# Altium schematic sheet DDS.SchDoc
size B; Organization: Mechanart, LLC; Address1: 397 Laurie Meadows Drive; Address2: Apt. 437; Address3: San Mateo, CA 94403
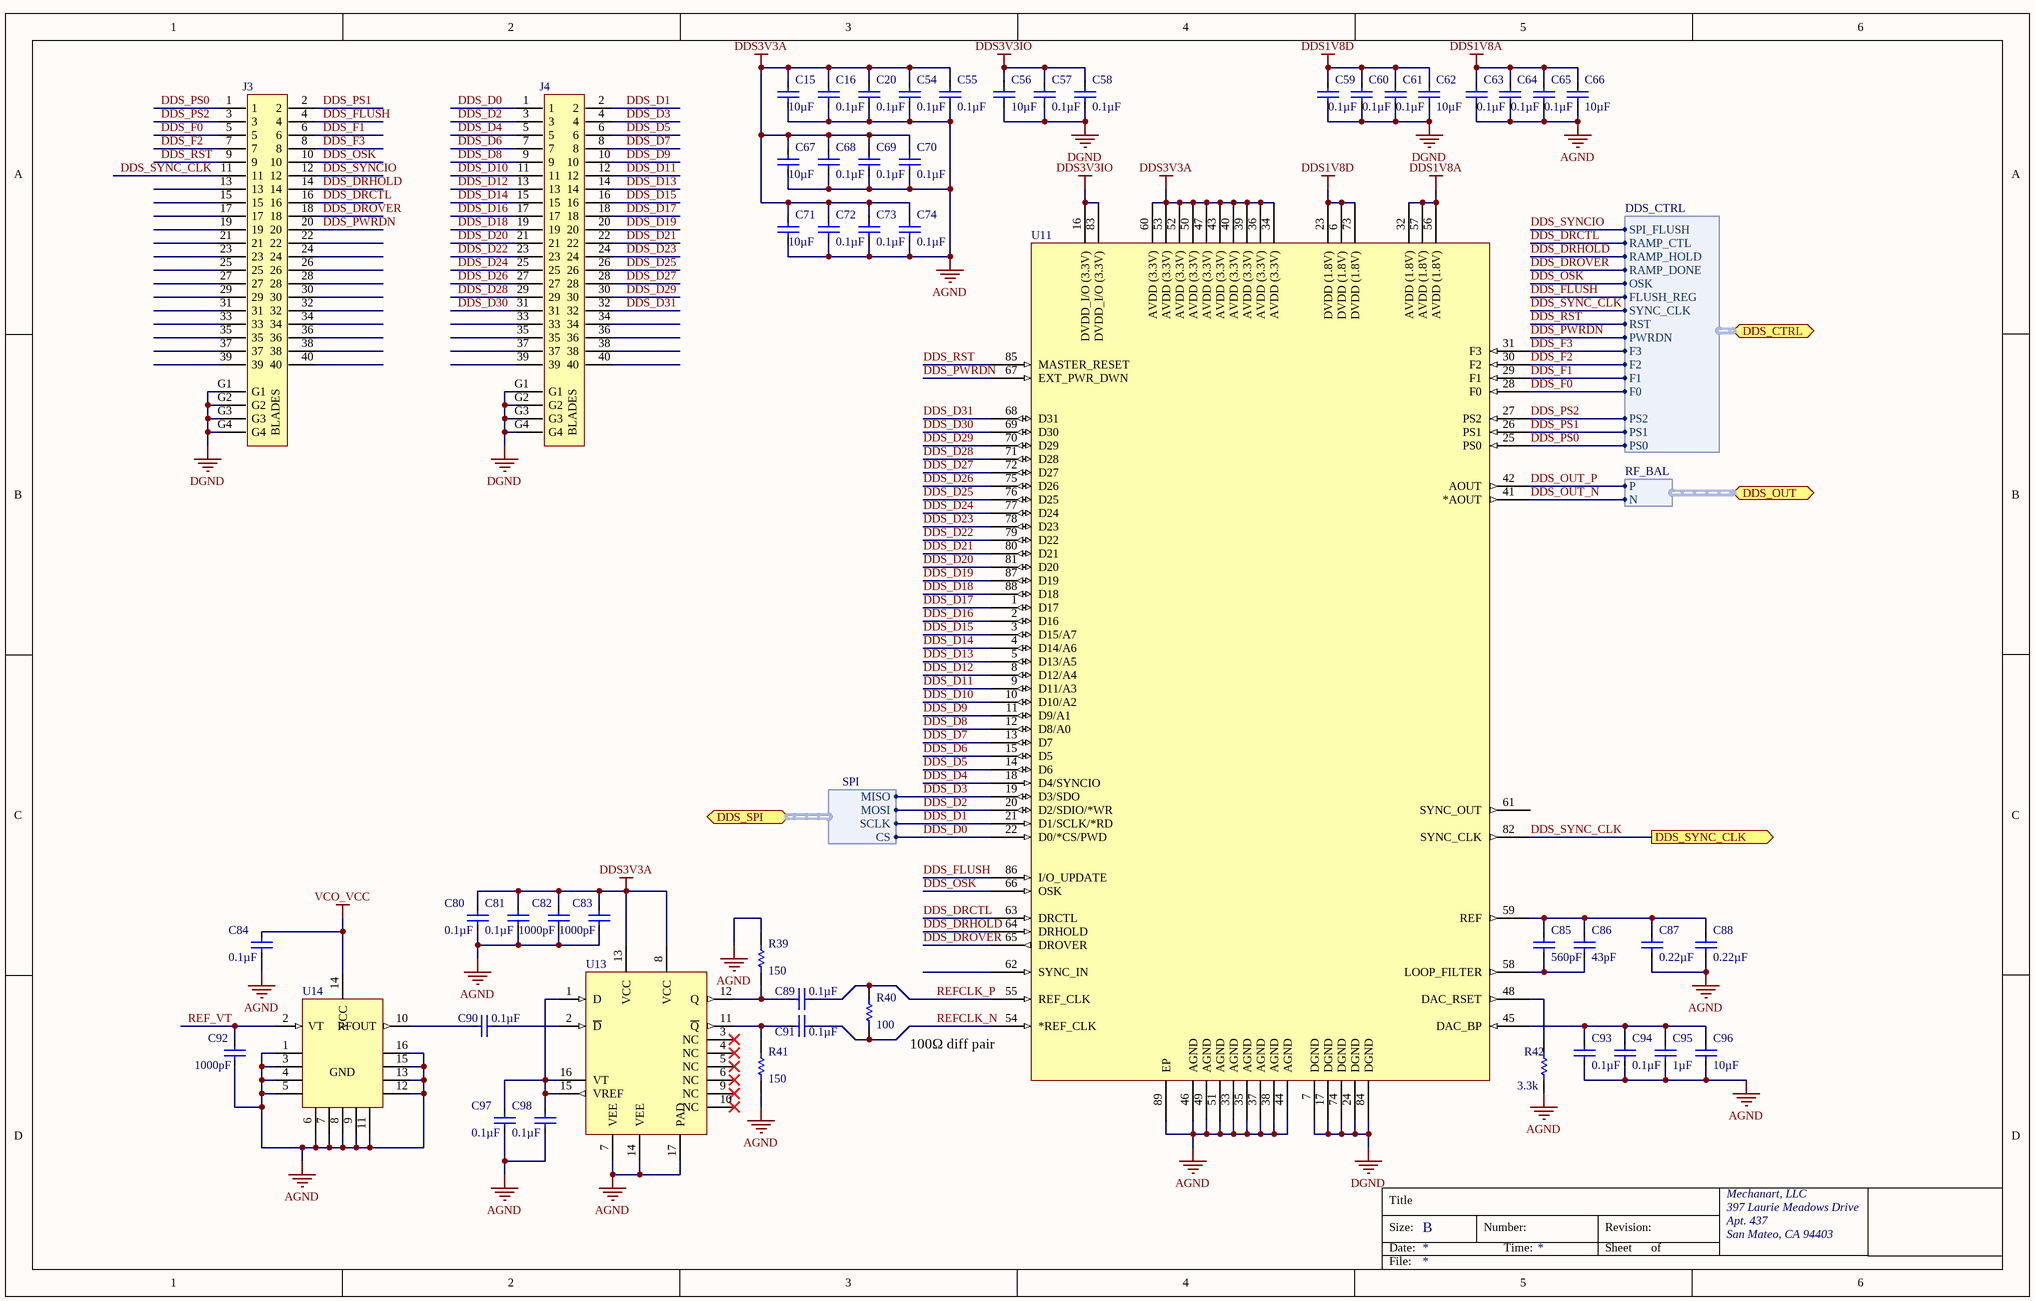
[diagram p0: DDS.SchDoc]

## Parts
C15  10µF  [CAPC1608X85L22N]
C16  0.1µF  [CAPC1005X55L25N]
C20  0.1µF  [CAPC1005X55L25N]
C54  0.1µF  [CAPC1005X55L25N]
C55  0.1µF  [CAPC1005X55L25N]
C56  10µF  [CAPC1608X85L22N]
C57  0.1µF  [CAPC1005X55L25N]
C58  0.1µF  [CAPC1005X55L25N]
C59  0.1µF  [CAPC1005X55L25N]
C60  0.1µF  [CAPC1005X55L25N]
C61  0.1µF  [CAPC1005X55L25N]
C62  10µF  [CAPC1608X85L22N]
C63  0.1µF  [CAPC1005X55L25N]
C64  0.1µF  [CAPC1005X55L25N]
C65  0.1µF  [CAPC1005X55L25N]
C66  10µF  [CAPC1608X85L22N]
C67  10µF  [CAPC1608X85L22N]
C68  0.1µF  [CAPC1005X55L25N]
C69  0.1µF  [CAPC1005X55L25N]
C70  0.1µF  [CAPC1005X55L25N]
C71  10µF  [CAPC1608X85L22N]
C72  0.1µF  [CAPC1005X55L25N]
C73  0.1µF  [CAPC1005X55L25N]
C74  0.1µF  [CAPC1005X55L25N]
C80  0.1µF  [CAPC1005X50L25N]
C81  0.1µF  [CAPC1005X50L25N]
C82  1000pF  [CAPC1005X50L25N]
C83  1000pF  [CAPC1005X50L25N]
C84  0.1µF  [CAPC1005X50L25N]
C85  560pF  [CAPC1005X50L25N]
C86  43pF  [CAPC1005X50L25N]
C87  0.22µF  [CAPC1005X50L25N]
C88  0.22µF  [CAPC1005X50L25N]
C89  0.1µF  [CAPC1005X55L25N]
C90  0.1µF  [CAPC1005X55L25N]
C91  0.1µF  [CAPC1005X55L25N]
C92  1000pF  [CAPC1005X50L25N]
C93  0.1µF  [CAPC1005X55L25N]
C94  0.1µF  [CAPC1005X55L25N]
C95  1µF  [CAPC1608X85L22N]
C96  10µF  [CAPC1608X85L22N]
C97  0.1µF  [CAPC1005X50L25N]
C98  0.1µF  [CAPC1005X50L25N]
J3  QSE-020-01-X-D-A  [QSE-020-01-X-D-A]  (value not drawn)
J4  QSE-020-01-X-D-A  [QSE-020-01-X-D-A]  (value not drawn)
R39  150  [RESC1005X40L25N]
R40  100  [RESC1005X40L25N]
R41  150  [RESC1005X40L25N]
R42  3.3k  [RESC1005X40L25N]
U11  AD9914BCPZ  [QFN50P1200X1200X90-89T670X670N]  (value not drawn)
U13  ADCLK905  [QFN50P300X300X90-17T150X150N]  (value not drawn)
U14  CVCO55  [CVCO55]  (value not drawn)

## Ports
DDS_CTRL (harness DDS_CTRL), DDS_OUT (harness RF_BAL), DDS_SPI (harness SPI), DDS_SYNC_CLK (out)

## Harnesses
RF_BAL: P, N
DDS_CTRL: F0, F1, F2, F3, PS0, PS1, PS2, RST, PWRDN, SYNC_CLK, RAMP_CTL, RAMP_HOLD, RAMP_DONE, OSK, FLUSH_REG, SPI_FLUSH
SPI: MISO, MOSI, SCLK, CS

## Nets
AGND: C15.2 C16.2 C20.2 C54.2 C55.2 C63.2 C64.2 C65.2 C66.2 C67.2 C68.2 C69.2 C70.2 C71.2 C72.2 C73.2 C74.2 C80.2 C81.2 C82.2 C83.2 C84.2 C87.2 C88.2 C92.2 C93.2 C94.2 C95.2 C96.2 C97.2 C98.2 R39.2 R41.1 R42.1 U11.33(AGND) U11.35(AGND) U11.37(AGND) U11.38(AGND) U11.44(AGND) U11.46(AGND) U11.49(AGND) U11.51(AGND) U11.89(EP) U13.7(VEE) U13.14(VEE) U13.17(PAD) U14.1(GND) U14.3(GND) U14.4(GND) U14.5(GND) U14.6(GND) U14.7(GND) U14.8(GND) U14.9(GND) U14.11(GND) U14.12(GND) U14.13(GND) U14.15(GND) U14.16(GND)
DDS1V8A: C63.1 C64.1 C65.1 C66.1 U11.32(AVDD_(1.8V)) U11.56(AVDD_(1.8V)) U11.57(AVDD_(1.8V))
DDS1V8D: C59.1 C60.1 C61.1 C62.1 U11.6(DVDD_(1.8V)) U11.23(DVDD_(1.8V)) U11.73(DVDD_(1.8V))
DDS3V3A: C15.1 C16.1 C20.1 C54.1 C55.1 C67.1 C68.1 C69.1 C70.1 C71.1 C72.1 C73.1 C74.1 C80.1 C81.1 C82.1 C83.1 U11.34(AVDD_(3.3V)) U11.36(AVDD_(3.3V)) U11.39(AVDD_(3.3V)) U11.40(AVDD_(3.3V)) U11.43(AVDD_(3.3V)) U11.47(AVDD_(3.3V)) U11.50(AVDD_(3.3V)) U11.52(AVDD_(3.3V)) U11.53(AVDD_(3.3V)) U11.60(AVDD_(3.3V)) U13.8(VCC) U13.13(VCC)
DDS3V3IO: C56.1 C57.1 C58.1 U11.16(DVDD_I/O_(3.3V)) U11.83(DVDD_I/O_(3.3V))
DGND: C56.2 C57.2 C58.2 C59.2 C60.2 C61.2 C62.2 J3.G1 J3.G2 J3.G3 J3.G4 J4.G1 J4.G2 J4.G3 J4.G4 U11.7(DGND) U11.17(DGND) U11.24(DGND) U11.74(DGND) U11.84(DGND)
VCO_VCC: C84.1 U14.14(VCC)
DDS_D0: J4.1 U11.22(D0/*CS/PWD) ; port DDS_SPI.CS
DDS_D1: J4.2 U11.21(D1/SCLK/*RD) ; port DDS_SPI.SCLK
DDS_D2: J4.3 U11.20(D2/SDIO/*WR) ; port DDS_SPI.MOSI
DDS_D3: J4.4 U11.19(D3/SDO) ; port DDS_SPI.MISO
DDS_D4: J4.5 U11.18(D4/SYNCIO)
DDS_D5: J4.6 U11.14(D6)
DDS_D6: J4.7 U11.15(D5)
DDS_D7: J4.8 U11.13(D7)
DDS_D8: J4.9 U11.12(D8/A0)
DDS_D9: J4.10 U11.11(D9/A1)
DDS_D10: J4.11 U11.10(D10/A2)
DDS_D11: J4.12 U11.9(D11/A3)
DDS_D12: J4.13 U11.8(D12/A4)
DDS_D13: J4.14 U11.5(D13/A5)
DDS_D14: J4.15 U11.4(D14/A6)
DDS_D15: J4.16 U11.3(D15/A7)
DDS_D16: J4.17 U11.2(D16)
DDS_D17: J4.18 U11.1(D17)
DDS_D18: J4.19 U11.88(D18)
DDS_D19: J4.20 U11.87(D19)
DDS_D20: J4.21 U11.81(D20)
DDS_D21: J4.22 U11.80(D21)
DDS_D22: J4.23 U11.79(D22)
DDS_D23: J4.24 U11.78(D23)
DDS_D24: J4.25 U11.77(D24)
DDS_D25: J4.26 U11.76(D25)
DDS_D26: J4.27 U11.75(D26)
DDS_D27: J4.28 U11.72(D27)
DDS_D28: J4.29 U11.71(D28)
DDS_D29: J4.30 U11.70(D29)
DDS_D30: J4.31 U11.69(D30)
DDS_D31: J4.32 U11.68(D31)
DDS_DRCTL: J3.16 U11.63(DRCTL) ; port DDS_CTRL.RAMP_CTL
DDS_DRHOLD: J3.14 U11.64(DRHOLD) ; port DDS_CTRL.RAMP_HOLD
DDS_DROVER: J3.18 U11.65(DROVER) ; port DDS_CTRL.RAMP_DONE
DDS_F0: J3.5 U11.28(F0) ; port DDS_CTRL.F0
DDS_F1: J3.6 U11.29(F1) ; port DDS_CTRL.F1
DDS_F2: J3.7 U11.30(F2) ; port DDS_CTRL.F2
DDS_F3: J3.8 U11.31(F3) ; port DDS_CTRL.F3
DDS_FLUSH: J3.4 U11.86(I/O_UPDATE) ; port DDS_CTRL.FLUSH_REG
DDS_OSK: J3.10 U11.66(OSK) ; port DDS_CTRL.OSK
DDS_OUT_N: U11.41(*AOUT) ; port DDS_OUT.N
DDS_OUT_P: U11.42(AOUT) ; port DDS_OUT.P
DDS_PS0: J3.1 U11.25(PS0) ; port DDS_CTRL.PS0
DDS_PS1: J3.2 U11.26(PS1) ; port DDS_CTRL.PS1
DDS_PS2: J3.3 U11.27(PS2) ; port DDS_CTRL.PS2
DDS_PWRDN: J3.20 U11.67(EXT_PWR_DWN) ; port DDS_CTRL.PWRDN
DDS_RST: J3.9 U11.85(MASTER_RESET) ; port DDS_CTRL.RST
DDS_SYNC_CLK: J3.11 U11.82(SYNC_CLK) ; port DDS_SYNC_CLK, port DDS_CTRL.SYNC_CLK
DDS_SYNCIO: J3.12 ; port DDS_CTRL.SPI_FLUSH
REF_VT: C92.1 U14.2(VT)
REFCLK_N: C91.2 R40.1 U11.54(*REF_CLK)
REFCLK_P: C89.2 R40.2 U11.55(REF_CLK)
NetC85_1: C85.1 C86.1 C87.1 C88.1 U11.59(REF)
NetC85_2: C85.2 C86.2 U11.58(LOOP_FILTER)
NetC89_1: C89.1 R39.1 U13.12(Q)
NetC90_1: C90.1 U14.10(RFOUT)
NetC90_2: C90.2 U13.2(~{D})
NetC91_1: C91.1 R41.2 U13.11(~{Q})
NetC93_1: C93.1 C94.1 C95.1 C96.1 U11.45(DAC_BP)
NetC97_1: C97.1 C98.1 U13.1(D) U13.15(VREF) U13.16(VT)
NetR42_2: R42.2 U11.48(DAC_RSET)

Not connected (* = marked no-connect by the designer): J3 13 15 17 19 21 22 23 24 25 26 27 28 29 30 31 32 33 34 35 36 37 38 39 40; J4 33 34 35 36 37 38 39 40; U11 61(SYNC_OUT) 62(SYNC_IN); U13 3(NC)* 4(NC)* 5(NC)* 6(NC)* 9(NC)* 10(NC)*

## Notes on the sheet
- (near U11) 100Ω diff pair
- Title
- Size:
- Date:
- B
- Number:
- Time:
- Revision:
- Sheet
- of
- File:
- (in symbol QSE-020-01-L-D-A) BLADES

## Library data of the parts
C15 C56 C62 C66 C67 C71 C96 = GRM31CR71E106KA12L: CAP CER 10UF 25V X7R 1206; Manufacturer: Murata Electronics North America; Tolerance: ±10%; Design Item Id: GRM31CR71E106KA12L; Supplier 1: Digi-Key; Supplier Part Number 1: 490-6518-1-ND; Manufacturer Part Number: GRM31CR71E106KA12L; RoHS: RoHS Compliant; Category: Capacitors; Stock 1: 157542; Pricing 1: 1=0.83, 10=0.706, 50=0.5194, 100=0.4129, 250=0.34632, 500=0.31302, 1000=0.28638 (USD); Packaging: Cut Tape (CT); Applications: General Purpose; Operating Temperature: -55°C ~ 125°C; Mounting Type: Surface Mount, MLCC; Package / Case: 1206 (3216 Metric); ComponentLink1URL: http://www.murata.com/~/media/webrenewal/support/library/catalog/products/capacitor/mlcc/c02e.pdf; ComponentLink1Description: http://www.murata.com/~/media/webrenewal/support/library/catalog/products/capacitor/mlcc/c02e.pdf; Capacitance: 10µF; Voltage - Rated: 25V; Temperature Coefficient: X7R; Ratings: -; Size / Dimension: 0.126" L x 0.063" W (3.20mm x 1.60mm); Height - Seated (Max): -; Thickness (Max): 0.071" (1.80mm); Lead Spacing: -; Features: -; Lead Style: -
C16 C20 C54 C55 C57-C61 C63-C65 C68-C70 C72-C74 C89-C91 C93 C94 = GRM155R71C104JA88D: CAP CER 0.1UF 16V X7R 0402; Manufacturer: Murata Electronics North America; Tolerance: ±5%; Design Item Id: GRM155R71C104JA88D; Supplier 1: Digi-Key; Supplier Part Number 1: 490-6327-1-ND; Manufacturer Part Number: GRM155R71C104JA88D; RoHS: RoHS Compliant; Category: Capacitors; Stock 1: 844721; Pricing 1: 1=0.1, 10=0.026, 50=0.0144, 100=0.0121, 250=0.00992, 500=0.00848, 1000=0.0066, 5000=0.0055 (USD); Packaging: Cut Tape (CT); Applications: General Purpose; Operating Temperature: -55°C ~ 125°C; Mounting Type: Surface Mount, MLCC; Package / Case: 0402 (1005 Metric); ComponentLink1URL: http://www.murata.com/~/media/webrenewal/support/library/catalog/products/capacitor/mlcc/c02e.pdf; ComponentLink1Description: http://www.murata.com/~/media/webrenewal/support/library/catalog/products/capacitor/mlcc/c02e.pdf; Capacitance: 0.1µF; Voltage - Rated: 16V; Temperature Coefficient: X7R; Ratings: -; Size / Dimension: 0.039" L x 0.020" W (1.00mm x 0.50mm); Height - Seated (Max): -; Thickness (Max): 0.022" (0.55mm); Lead Spacing: -; Features: -; Lead Style: *
C80 C81 C84 C97 C98 = GRM155R71H104KE14D: CAP CER 0.1UF 50V X7R 0402; Manufacturer: Murata Electronics North America; Tolerance: ±10%; Design Item Id: GRM155R71H104KE14D; Supplier 1: Digi-Key; Supplier Part Number 1: 490-10700-1-ND; Manufacturer Part Number: GRM155R71H104KE14D; RoHS: RoHS Compliant; Category: Capacitors; Stock 1: 28600; Pricing 1: 1=0.1, 10=0.029, 50=0.0156, 100=0.0132, 250=0.0108, 500=0.00924, 1000=0.0072, 5000=0.006 (USD); Packaging: Cut Tape (CT); Applications: General Purpose; Operating Temperature: -55°C ~ 125°C; Mounting Type: Surface Mount, MLCC; Package / Case: 0402 (1005 Metric); ComponentLink1URL: http://www.murata.com/~/media/webrenewal/support/library/catalog/products/capacitor/mlcc/c02e.ashx; ComponentLink1Description: http://www.murata.com/~/media/webrenewal/support/library/catalog/products/capacitor/mlcc/c02e.ashx; Capacitance: 0.1µF; Voltage - Rated: 50V; Temperature Coefficient: X7R; Ratings: -; Size / Dimension: 0.039" L x 0.020" W (1.00mm x 0.50mm); Height - Seated (Max): -; Thickness (Max): 0.022" (0.55mm); Lead Spacing: -; Features: -; Lead Style: -
C82 C83 C92 = GRM1555C1H102JA01D: CAP CER 1000PF 50V NP0 0402; Manufacturer: Murata Electronics North America; Tolerance: ±5%; Temperature Coefficient: C0G, NP0; Design Item Id: GRM1555C1H102JA01D; Supplier 1: Digi-Key; Supplier Part Number 1: 490-3244-1-ND; Manufacturer Part Number: GRM1555C1H102JA01D; RoHS: RoHS Compliant; Category: Capacitors; Stock 1: 4551320; Pricing 1: 1=0.1, 10=0.065, 50=0.0354, 100=0.03, 250=0.02452, 500=0.02098, 1000=0.01635, 5000=0.01363 (USD); Packaging: Cut Tape (CT); Applications: General Purpose; Operating Temperature: -55°C ~ 125°C; Mounting Type: Surface Mount, MLCC; Package / Case: 0402 (1005 Metric); ComponentLink1URL: http://www.murata.com/~/media/webrenewal/support/library/catalog/products/capacitor/mlcc/c02e.pdf; ComponentLink1Description: http://www.murata.com/~/media/webrenewal/support/library/catalog/products/capacitor/mlcc/c02e.pdf; Capacitance: 1000pF; Voltage - Rated: 50V; Ratings: -; Size / Dimension: 0.039" L x 0.020" W (1.00mm x 0.50mm); Height - Seated (Max): -; Thickness (Max): 0.022" (0.55mm); Lead Spacing: -; Features: -; Lead Style: -
C85 = GRM1555C1H561JA01D: CAP CER 560PF 50V NP0 0402; Manufacturer: Murata Electronics North America; Tolerance: ±5%; Temperature Coefficient: C0G, NP0; Design Item Id: GRM1555C1H561JA01D; Supplier 1: Digi-Key; Supplier Part Number 1: 490-3238-1-ND; Manufacturer Part Number: GRM1555C1H561JA01D; RoHS: RoHS Compliant; Category: Capacitors; Stock 1: 73113; Pricing 1: 1=0.1, 10=0.053, 50=0.0286, 100=0.0242, 250=0.0198, 500=0.01694, 1000=0.0132, 5000=0.011 (USD); Packaging: Cut Tape (CT); Applications: General Purpose; Operating Temperature: -55°C ~ 125°C; Mounting Type: Surface Mount, MLCC; Package / Case: 0402 (1005 Metric); ComponentLink1URL: http://www.murata.com/~/media/webrenewal/support/library/catalog/products/capacitor/mlcc/c02e.pdf; ComponentLink1Description: http://www.murata.com/~/media/webrenewal/support/library/catalog/products/capacitor/mlcc/c02e.pdf; Capacitance: 560pF; Voltage - Rated: 50V; Ratings: -; Size / Dimension: 0.039" L x 0.020" W (1.00mm x 0.50mm); Height - Seated (Max): -; Thickness (Max): 0.022" (0.55mm); Lead Spacing: -; Features: -; Lead Style: -
C86 = GRM1555C1H430JA01D: CAP CER 43PF 50V NP0 0402; Manufacturer: Murata Electronics North America; Tolerance: ±5%; Temperature Coefficient: C0G, NP0; Design Item Id: GRM1555C1H430JA01D; Supplier 1: Digi-Key; Supplier Part Number 1: 490-5941-1-ND; Manufacturer Part Number: GRM1555C1H430JA01D; RoHS: RoHS Compliant; Category: Capacitors; Stock 1: 105146; Pricing 1: 1=0.1, 10=0.026, 50=0.0144, 100=0.0121, 250=0.00992, 500=0.00848, 1000=0.0066, 5000=0.0055 (USD); Packaging: Cut Tape (CT); Applications: General Purpose; Operating Temperature: -55°C ~ 125°C; Mounting Type: Surface Mount, MLCC; Package / Case: 0402 (1005 Metric); ComponentLink1URL: http://www.murata.com/~/media/webrenewal/support/library/catalog/products/capacitor/mlcc/c02e.pdf; ComponentLink1Description: http://www.murata.com/~/media/webrenewal/support/library/catalog/products/capacitor/mlcc/c02e.pdf; Capacitance: 43pF; Voltage - Rated: 50V; Ratings: -; Size / Dimension: 0.039" L x 0.020" W (1.00mm x 0.50mm); Height - Seated (Max): -; Thickness (Max): 0.022" (0.55mm); Lead Spacing: -; Features: -; Lead Style: -
C87 C88 = GRT155R6YA224KE01D: CAP CER 0.22UF 35V 10% X5R 0402; Manufacturer: Murata Electronics North America; Design Item Id: GRT155R6YA224KE01D; Supplier 1: Digi-Key; Supplier Part Number 1: 490-12271-1-ND; Manufacturer Part Number: GRT155R6YA224KE01D; RoHS: RoHS Compliant; Category: Capacitors; Stock 1: 8428; Pricing 1: 1=0.1, 10=0.054, 50=0.0292, 100=0.0248, 250=0.02024, 500=0.01732, 1000=0.0135, 5000=0.01125 (USD); Packaging: Cut Tape (CT); Applications: Automotive; Operating Temperature: -55°C ~ 85°C; Mounting Type: Surface Mount, MLCC; Package / Case: 0402 (1005 Metric); ComponentLink1URL: http://search.murata.co.jp/Ceramy/image/img/A01X/G101/ENG/GRT155R6YA224KE01-01.pdf; ComponentLink1Description: http://search.murata.co.jp/Ceramy/image/img/A01X/G101/ENG/GRT155R6YA224KE01-01.pdf; Capacitance: 0.22µF; Tolerance: ±10%; Voltage - Rated: 35V; Temperature Coefficient: X5R; Ratings: AEC-Q200; Size / Dimension: 0.039" L x 0.020" W (1.00mm x 0.50mm); Height - Seated (Max): -; Thickness (Max): 0.022" (0.55mm); Lead Spacing: -; Features: Derating Recommended; Lead Style: -
C95 = EMK107B7105KA-T: CAP CER 1UF 16V X7R 0603; Manufacturer: Taiyo Yuden; Tolerance: ±10%; Design Item Id: EMK107B7105KA-T; Supplier 1: Digi-Key; Supplier Part Number 1: 587-1241-1-ND; Manufacturer Part Number: EMK107B7105KA-T; RoHS: RoHS Compliant; Category: Capacitors; Stock 1: 3073749; Pricing 1: 1=0.1, 10=0.06, 50=0.0326, 100=0.0275, 250=0.02252, 500=0.01926, 1000=0.015 (USD); Packaging: Cut Tape (CT); Applications: General Purpose; Operating Temperature: -55°C ~ 125°C; Mounting Type: Surface Mount, MLCC; Package / Case: 0603 (1608 Metric); ComponentLink1URL: http://ds.yuden.co.jp/TYCOMPAS/ut/detail.do?productNo=EMK107B7105KA-T&fileName=EMK107B7105KA-T_SS&mode=specSheetDownload; ComponentLink1Description: http://ds.yuden.co.jp/TYCOMPAS/ut/detail.do?productNo=EMK107B7105KA-T&fileName=EMK107B7105KA-T_SS&mode=specSheetDownload; Capacitance: 1µF; Voltage - Rated: 16V; Temperature Coefficient: X7R; Ratings: -; Size / Dimension: 0.063" L x 0.031" W (1.60mm x 0.80mm); Height - Seated (Max): -; Thickness (Max): 0.035" (0.90mm); Lead Spacing: -; Features: -; Lead Style: -
J3 J4 = QSE-020-01-L-D-A: CONN RCPT HI-SPEED DUAL 40POS; Manufacturer: Samtec Inc.; Connector Type: Receptacle, Center Strip Contacts; Number of Positions: 40; Pitch: 0.031" (0.80mm); Design Item Id: QSE-020-01-L-D-A; Supplier 1: Digi-Key; Supplier Part Number 1: SAM8123-ND; Manufacturer Part Number: QSE-020-01-L-D-A; RoHS: RoHS Compliant; Category: Connectors, Interconnects; Stock 1: 1862; Pricing 1: 1=7.22, 10=6.594, 50=5.652, 100=5.024, 250=4.553, 500=4.239, 1000=4.0035, 2500=3.8465, 5000=3.768 (USD); Packaging: Tray; Mounting Type: Surface Mount; Number of Rows: 2; Features: Board Guide, Ground Bus (Plane); Contact Finish: Gold; Contact Finish Thickness: 10µin (0.25µm)
R39 R41 = ERJ-2RKF1500X: RES SMD 150 OHM 1% 1/10W 0402; Manufacturer: Panasonic Electronic Components; Power (Watts): 0.1W, 1/10W; Temperature Coefficient: ±100ppm/°C; Resistance: 150; Design Item Id: ERJ-2RKF1500X; Footprint: RESC_1005[0402]_N; Supplier 1: Digi-Key; Supplier Part Number 1: P150LCT-ND; Manufacturer Part Number: ERJ-2RKF1500X; RoHS: RoHS Compliant; Category: Resistors; Stock 1: 1792947; Pricing 1: 1=0.1, 50=0.015, 100=0.011, 250=0.0084, 500=0.00674, 1000=0.00496, 5000=0.00355 (USD); Packaging: Cut Tape (CT); Operating Temperature: -55°C ~ 155°C; Package / Case: 0402 (1005 Metric); Supplier Device Package: 0402; ComponentLink1URL: http://industrial.panasonic.com/www-cgi/jvcr13pz.cgi?E+PZ+3+AOA0002+ERJ2RKF1500X+7+WW; ComponentLink1Description: http://industrial.panasonic.com/www-cgi/jvcr13pz.cgi?E+PZ+3+AOA0002+ERJ2RKF1500X+7+WW; Tolerance: ±1%; Composition: Thick Film; Features: Automotive AEC-Q200; Size / Dimension: 0.039" L x 0.020" W (1.00mm x 0.50mm); Height: 0.016" (0.40mm); Number of Terminations: 2
R40 = ERJ-2RKF1000X: RES SMD 100 OHM 1% 1/10W 0402; Manufacturer: Panasonic Electronic Components; Power (Watts): 0.1W, 1/10W; Temperature Coefficient: ±100ppm/°C; Resistance: 100; Design Item Id: ERJ-2RKF1000X; Footprint: RESC_1005[0402]_N; Supplier 1: Digi-Key; Supplier Part Number 1: P100LCT-ND; Manufacturer Part Number: ERJ-2RKF1000X; RoHS: RoHS Compliant; Category: Resistors; Stock 1: 7555921; Pricing 1: 1=0.1, 50=0.015, 100=0.011, 250=0.0084, 500=0.00674, 1000=0.00496, 5000=0.00355 (USD); Packaging: Cut Tape (CT); Operating Temperature: -55°C ~ 155°C; Package / Case: 0402 (1005 Metric); Supplier Device Package: 0402; ComponentLink1URL: http://industrial.panasonic.com/www-cgi/jvcr13pz.cgi?E+PZ+3+AOA0002+ERJ2RKF1000X+7+WW; ComponentLink1Description: http://industrial.panasonic.com/www-cgi/jvcr13pz.cgi?E+PZ+3+AOA0002+ERJ2RKF1000X+7+WW; Tolerance: ±1%; Composition: Thick Film; Features: Automotive AEC-Q200; Size / Dimension: 0.039" L x 0.020" W (1.00mm x 0.50mm); Height: 0.016" (0.40mm); Number of Terminations: 2
R42 = ERJ-2RKF3301X: RES SMD 3.3K OHM 1% 1/10W 0402; Manufacturer: Panasonic Electronic Components; Power (Watts): 0.1W, 1/10W; Temperature Coefficient: ±100ppm/°C; Resistance: 3.3k; Design Item Id: ERJ-2RKF3301X; Footprint: RESC_1005[0402]_N; Supplier 1: Digi-Key; Supplier Part Number 1: P3.30KLCT-ND; Manufacturer Part Number: ERJ-2RKF3301X; RoHS: RoHS Compliant; Category: Resistors; Stock 1: 715368; Pricing 1: 1=0.1, 50=0.015, 100=0.011, 250=0.0084, 500=0.00674, 1000=0.00496, 5000=0.00355 (USD); Packaging: Cut Tape (CT); Operating Temperature: -55°C ~ 155°C; Package / Case: 0402 (1005 Metric); Supplier Device Package: 0402; ComponentLink1URL: http://industrial.panasonic.com/www-cgi/jvcr13pz.cgi?E+PZ+3+AOA0002+ERJ2RKF3301X+7+WW; ComponentLink1Description: http://industrial.panasonic.com/www-cgi/jvcr13pz.cgi?E+PZ+3+AOA0002+ERJ2RKF3301X+7+WW; Tolerance: ±1%; Composition: Thick Film; Features: Automotive AEC-Q200; Size / Dimension: 0.039" L x 0.020" W (1.00mm x 0.50mm); Height: 0.016" (0.40mm); Number of Terminations: 2
U11 = AD9914BCPZ: IC DDS 3.5GSPS DAC 12BIT 88LFCSP; Manufacturer: Analog Devices Inc; RefDes: RefDes; Type: DEV; Value: Value; Design Item Id: AD9914BCPZ; Supplier 1: Digi-Key; Supplier Part Number 1: AD9914BCPZ-ND; Manufacturer Part Number: AD9914BCPZ; RoHS: RoHS Compliant; Category: Integrated Circuits (ICs); Stock 1: 200; Pricing 1: 1=191.16, 10=181.927, 100=171.381, 250=168.74432, 500=166.524 (USD); ComponentLink1URL: http://www.analog.com/static/imported-files/data_sheets/AD9914.pdf; ComponentLink1Description: http://www.analog.com/static/imported-files/data_sheets/AD9914.pdf
U13 = ADCLK905BCPZ-R7: IC CLK BUFFER 1:1 7.5GHZ 16LFCSP; Manufacturer: Analog Devices Inc.; Voltage - Supply: 2.375 V ~ 3.63 V; Number of Circuits: 1; Input: Clock; Output: ECL, NECL, PECL; Design Item Id: ADCLK905BCPZ-R7; Supplier 1: Digi-Key; Supplier Part Number 1: ADCLK905BCPZ-R7CT-ND; Manufacturer Part Number: ADCLK905BCPZ-R7; RoHS: RoHS Compliant; Category: Integrated Circuits (ICs); Stock 1: 1441; Pricing 1: 1=10.66, 10=9.659, 100=7.9623, 500=6.9616 (USD); Packaging: Cut Tape (CT); Operating Temperature: -40°C ~ 125°C; Mounting Type: Surface Mount; Package / Case: 16-VFQFN Exposed Pad, CSP; Supplier Device Package: 16-LFCSP-VQ (3x3); ComponentLink1URL: http://www.analog.com/media/en/technical-documentation/data-sheets/ADCLK905_907_925.pdf; ComponentLink1Description: http://www.analog.com/media/en/technical-documentation/data-sheets/ADCLK905_907_925.pdf; Type: Buffer/Driver, Data; Frequency - Max: 7.5GHz
U14 = CVCO55CC-3500-3700: OSC CRO 3500-3700 MHZ SMD .5X.5"; Manufacturer: Crystek Corporation; Voltage - Supply: 8V; Frequency Range: 3500 ~ 3700MHz; Frequency - Center: 3600MHz; Tuning Voltage (VDC): 0.1 ~ 16 V; 2nd Harmonic, Typ (dBc): -20; Icc Max: 40mA; Kvco (MHz/V): 2; Power (dBm): 5 ±2; Phase Noise Typ (dBc/Hz): -108; Design Item Id: CVCO55CC-3500-3700; Supplier 1: Digi-Key; Supplier Part Number 1: 744-1598-ND; Manufacturer Part Number: CVCO55CC-3500-3700; RoHS: RoHS Compliant; Category: Crystals and Oscillators; Stock 1: 4; Pricing 1: 1=35.09, 5=33.5, 10=30.31, 25=28.71, 50=27.12 (USD); Packaging: Cut Strip; Operating Temperature: -40°C ~ 85°C; Package / Case: 16-QFN, Variant; Size / Dimension: 0.500" L x 0.500" W (12.70mm x 12.70mm); Height: 0.220" (5.59mm); ComponentLink1URL: http://www.crystek.com/microwave/admin/webapps/welcome/files/vco/CVCO55CC-3500-3700.pdf; ComponentLink1Description: http://www.crystek.com/microwave/admin/webapps/welcome/files/vco/CVCO55CC-3500-3700.pdf